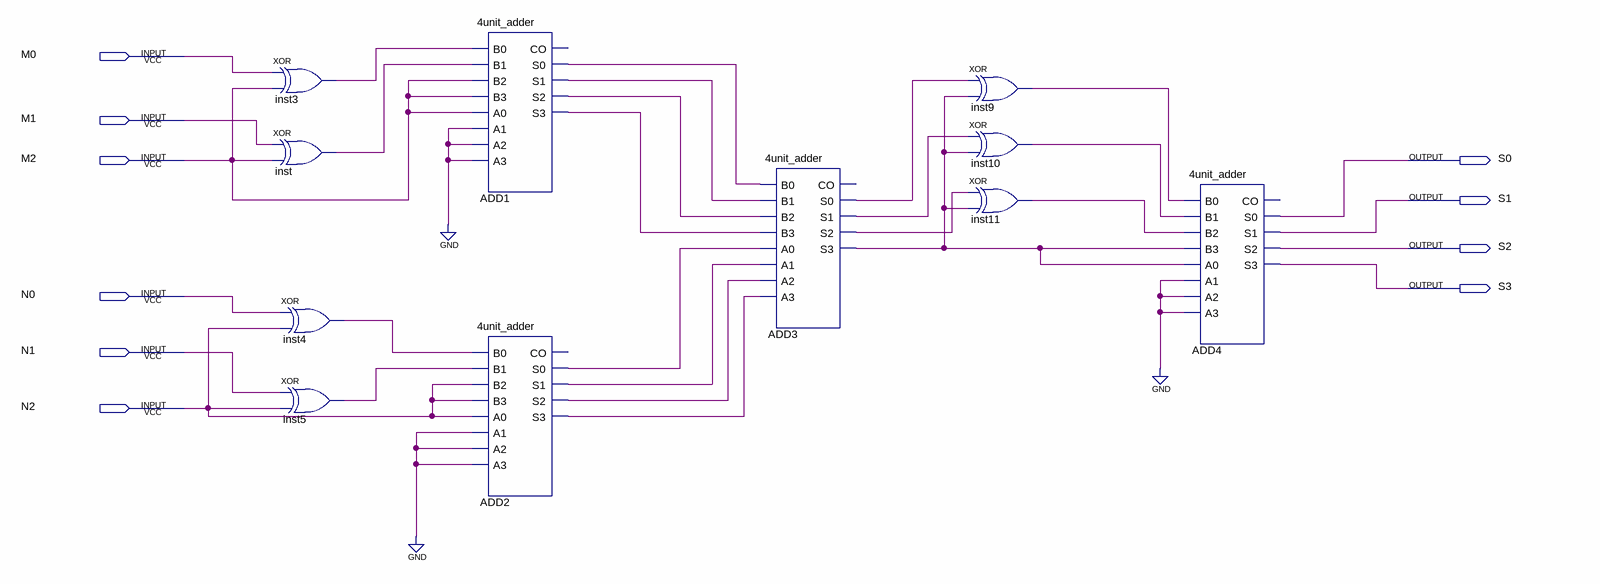
[diagram p0: schematic sheet]
// Quartus schematic MN.bdf as structural Verilog: 11 symbols, 10 pins
module MN (
  input  M0,
  input  M1,
  input  M2,
  input  N0,
  input  N1,
  input  N2,
  output S0,
  output S1,
  output S2,
  output S3
);

  wire ADD1_s0, ADD1_s1, ADD1_s2, ADD1_s3, ADD2_s0, ADD2_s1, ADD2_s2, ADD2_s3, ADD3_s0, ADD3_s1, ADD3_s2,
       ADD3_s3, inst3_out, inst4_out, inst5_out, inst9_out, inst10_out, inst11_out, inst_out;

  xor inst3 (inst3_out, M0, M2);
  xor inst (inst_out, M1, M2);
  xor inst4 (inst4_out, N0, N2);
  xor inst5 (inst5_out, N1, N2);
  \4unit_adder  ADD1 (
    .B0(inst3_out), .B1(inst_out), .B2(M2), .B3(M2), .A0(M2), .A1(1'b0), .A2(1'b0), .A3(1'b0), .S0(ADD1_s0),
    .S1(ADD1_s1), .S2(ADD1_s2), .S3(ADD1_s3));  // open: CO
  \4unit_adder  ADD2 (
    .B0(inst4_out), .B1(inst5_out), .B2(N2), .B3(N2), .A0(N2), .A1(1'b0), .A2(1'b0), .A3(1'b0), .S0(ADD2_s0),
    .S1(ADD2_s1), .S2(ADD2_s2), .S3(ADD2_s3));  // open: CO
  \4unit_adder  ADD3 (
    .B0(ADD1_s0), .B1(ADD1_s1), .B2(ADD1_s2), .B3(ADD1_s3), .A0(ADD2_s0), .A1(ADD2_s1), .A2(ADD2_s2),
    .A3(ADD2_s3), .S0(ADD3_s0), .S1(ADD3_s1), .S2(ADD3_s2), .S3(ADD3_s3));  // open: CO
  xor inst9 (inst9_out, ADD3_s0, ADD3_s3);
  xor inst10 (inst10_out, ADD3_s1, ADD3_s3);
  xor inst11 (inst11_out, ADD3_s2, ADD3_s3);
  \4unit_adder  ADD4 (
    .B0(inst9_out), .B1(inst10_out), .B2(inst11_out), .B3(ADD3_s3), .A0(ADD3_s3), .A1(1'b0), .A2(1'b0),
    .A3(1'b0), .S0(S0), .S1(S1), .S2(S2), .S3(S3));  // open: CO
endmodule
